# EAGLE design Pi_CPU_002 (EAGLE 6.4)
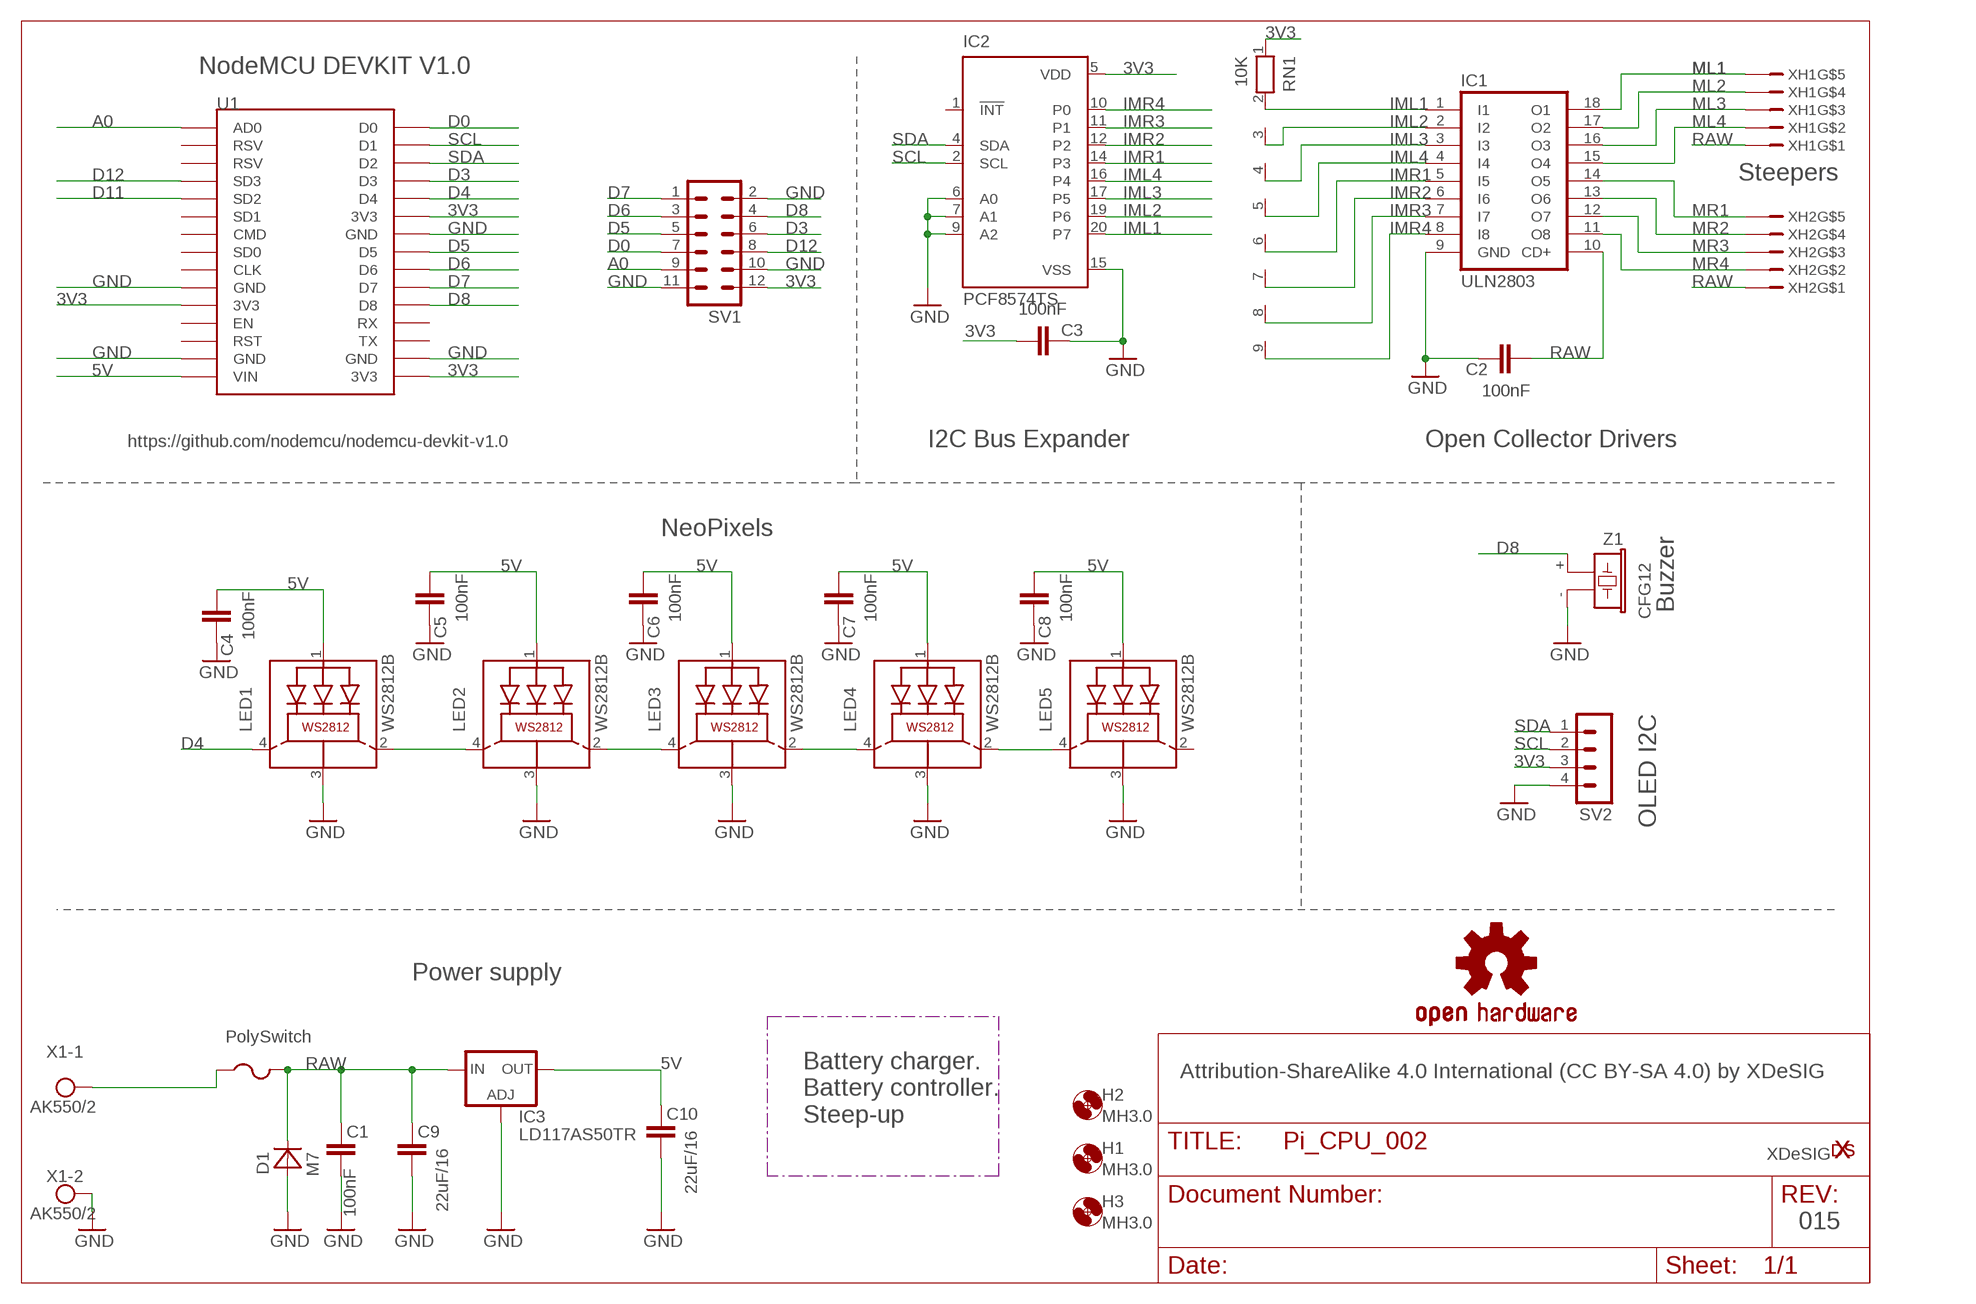
[diagram p0: schematic, sheet 1]

## Parts
C1  100nF  C-EUC0603K  [C0603K]
C2  100nF  C-EUC0603K  [C0603K]
C3  100nF  C-EUC0603K  [C0603K]
C4  100nF  C-EUC0603K  [C0603K]
C5  100nF  C-EUC0603K  [C0603K]
C6  100nF  C-EUC0603K  [C0603K]
C7  100nF  C-EUC0603K  [C0603K]
C8  100nF  C-EUC0603K  [C0603K]
C9  22uF/16  C-EUC1206  [C1206]
C10  22uF/16  C-EUC1206  [C1206]
D1  M7  MBRA340T3  [SMA]
F1  PolySwitch  PTCFUSE-1206  [R1206]
H1  MH3.0  MOUNT-HOLE3.0  [3,0]
H2  MH3.0  MOUNT-HOLE3.0  [3,0]
H3  MH3.0  MOUNT-HOLE3.0  [3,0]
IC1  ULN2803  ULN2803A  [DIL18]
IC2  PCF8574TS  [SSOP20]
IC3  LD117AS50TR  [SOT223]
LED1  WS2812B  [5050-4]
LED2  WS2812B  [5050-4]
LED3  WS2812B  [5050-4]
LED4  WS2812B  [5050-4]
LED5  WS2812B  [5050-4]
LOGO2  OSHW-LOGOS  [OSHW-LOGO-S]
RN1  10K  RN08  [RN-9]
SV1  MA06-2  [MA06-2]
SV2  MA04-1  [MA04-1]
U1  ESP12E_DEVKIT  [ESP12E_DEVKIT]
U$13  XDESIG_XDESIG21  [XDESIG_XDESIG]
X1  AK550/2  [AK550/2]
XDS1  XDESIG  [XDESIG_CU_2]
XH1  B5B-XH-A  [B5B-XH-A]
XH2  B5B-XH-A  [B5B-XH-A]
Z1  CFG12  F/CM12P  [F/CM12P]

## Nets
3V3: C3.2 IC2.5(VDD) RN1.1 SV1.12 SV2.3 U1.3V3@0(3V3) U1.3V3@1(3V3) U1.3V3@2(3V3)
5V: C4.2 C5.2 C6.2 C7.2 C8.2 C10.2 IC3.4(OUT) LED1.1(LEDVDD) LED2.1(LEDVDD) LED3.1(LEDVDD) LED4.1(LEDVDD) LED5.1(LEDVDD) U1.VIN
A0: SV1.9 U1.AD0
D0: SV1.7 U1.D0
D3: SV1.6 U1.D3
D4: LED1.4(DI) U1.D4
D5: SV1.5 U1.D5
D6: SV1.3 U1.D6
D7: SV1.1 U1.D7
D8: SV1.4 U1.D8 Z1.+
D11: U1.SD2
D12: SV1.8 U1.SD3
GND: C1.1 C2.1 C3.1 C4.1 C5.1 C6.1 C7.1 C8.1 C9.1 C10.1 D1.A IC1.9(GND) IC2.6(A0) IC2.7(A1) IC2.9(A2) IC2.15(VSS) IC3.1(ADJ) LED1.3(GND) LED2.3(GND) LED3.3(GND) LED4.3(GND) LED5.3(GND) SV1.2 SV1.10 SV1.11 SV2.4 U1.GND@0(GND) U1.GND@1(GND) U1.GND@2(GND) U1.GND@3(GND) X1.2 Z1.-
IML1: IC1.1(I1) IC2.20(P7) RN1.2
IML2: IC1.2(I2) IC2.19(P6) RN1.3
IML3: IC1.3(I3) IC2.17(P5) RN1.4
IML4: IC1.4(I4) IC2.16(P4) RN1.5
IMR1: IC1.5(I5) IC2.14(P3) RN1.6
IMR2: IC1.6(I6) IC2.12(P2) RN1.7
IMR3: IC1.7(I7) IC2.11(P1) RN1.8
IMR4: IC1.8(I8) IC2.10(P0) RN1.9
ML1: IC1.18(O1) XH1.P$5
ML2: IC1.17(O2) XH1.P$4
ML3: IC1.16(O3) XH1.P$3
ML4: IC1.15(O4) XH1.P$2
MR1: IC1.14(O5) XH2.P$5
MR2: IC1.13(O6) XH2.P$4
MR3: IC1.12(O7) XH2.P$3
MR4: IC1.11(O8) XH2.P$2
N$1: F1.1 X1.1
N$10: LED1.2(DO) LED2.4(DI)
N$14: LED3.2(DO) LED4.4(DI)
N$15: LED2.2(DO) LED3.4(DI)
N$16: LED4.2(DO) LED5.4(DI)
RAW: C1.2 C2.2 C9.2 D1.C F1.2 IC1.10(CD+) IC3.3(IN) XH1.P$1 XH2.P$1
SCL: IC2.2(SCL) SV2.2 U1.D1
SDA: IC2.4(SDA) SV2.1 U1.D2
Unconnected: IC2.1(!INT) LED5.2(DO) U1.CLK U1.CMD U1.EN U1.RST U1.RSV@0(RSV) U1.RSV@1(RSV) U1.RX U1.SD0 U1.SD1 U1.TX

## Notes on the sheet
- NodeMCU DEVKIT V1.0
- Steepers
- https://github.com/nodemcu/nodemcu-devkit-v1.0 | I2C Bus Expander | Open Collector Drivers
- NeoPixels | Buzzer
- OLED I2C
- Power supply
- Attribution-ShareAlike 4.0 International (CC BY-SA 4.0) by XDeSIG
- Battery charger.
  Battery controller.
  Steep-up
- XDeSIG
- 015

## Library data of the parts
C1-C10 = rcl:C-EU: CAPACITOR, European symbol
D1 = diode:MBRA340T3: Surface Mount Schottky Power Rectifier Source: http://www.onsemi.com/pub_link/Collateral/MBRA340T3-D.PDF
F1 = adafruit:PTCFUSE: PTC fuses, resettable thermistors
H1-H3 = holes:MOUNT-HOLE: MOUNTING HOLE with drill center marker
IC1 = uln-udn:ULN2803A: DRIVER ARRAY
IC2 = micro-philips:PCF8574: I2C-Bus Remote 8-bit I/O expander http://www.semiconductors.philips.com/acrobat_download/datasheets/PCF8574_4.pdf; MPN: PCF8574TS/3,118; OC_FARNELL: 1506644; OC_NEWARK: 70R6873
IC3 = v-reg:LD117A?*: Low drop fixed and adjustable positive voltage regulators 1 A Source: http://www.st.com/stonline/products/literature/ds/7194/ld1117axx.pdf
LED1-LED5 = adafruit:WS2812B
LOGO2 = SparkFun-Aesthetics:OSHW-LOGO: Open Source Hardware Logo This logo indicates the piece of hardware it is found on incorporates a OSHW license and/or adheres to the definition of open source hardware found here: http://freedomdefined.org/OSHW
RN1 = resistor-net:RN08: RESISTOR NETWORK; OC_FARNELL: unknown; OC_NEWARK: unknown
SV1 = con-lstb:MA06-2: PIN HEADER; OC_FARNELL: unknown; OC_NEWARK: unknown
SV2 = con-lstb:MA04-1: PIN HEADER; OC_FARNELL: unknown; OC_NEWARK: unknown
U1 = ESP12E_DEVKIT09:ESP12E_DEVKIT: ESP12E DEVKIT BOARD
U$13 = Escorna_CPU_2_01:XDESIG_XDESIG
X1 = con-ptr500:AK550/2: CONNECTOR; OC_FARNELL: unknown; OC_NEWARK: unknown
XDS1 = xdesig:XDESIG
XH1 XH2 = con-jst:B5B-XH-A
Z1 = buzzer:F/CM12P: BUZZER Source: Buerklin; OC_FARNELL: unknown; OC_NEWARK: unknown

## Net classes
1 power: width 0.254 mm, drill 0.61 mm, clearance 0.254 mm

## Board
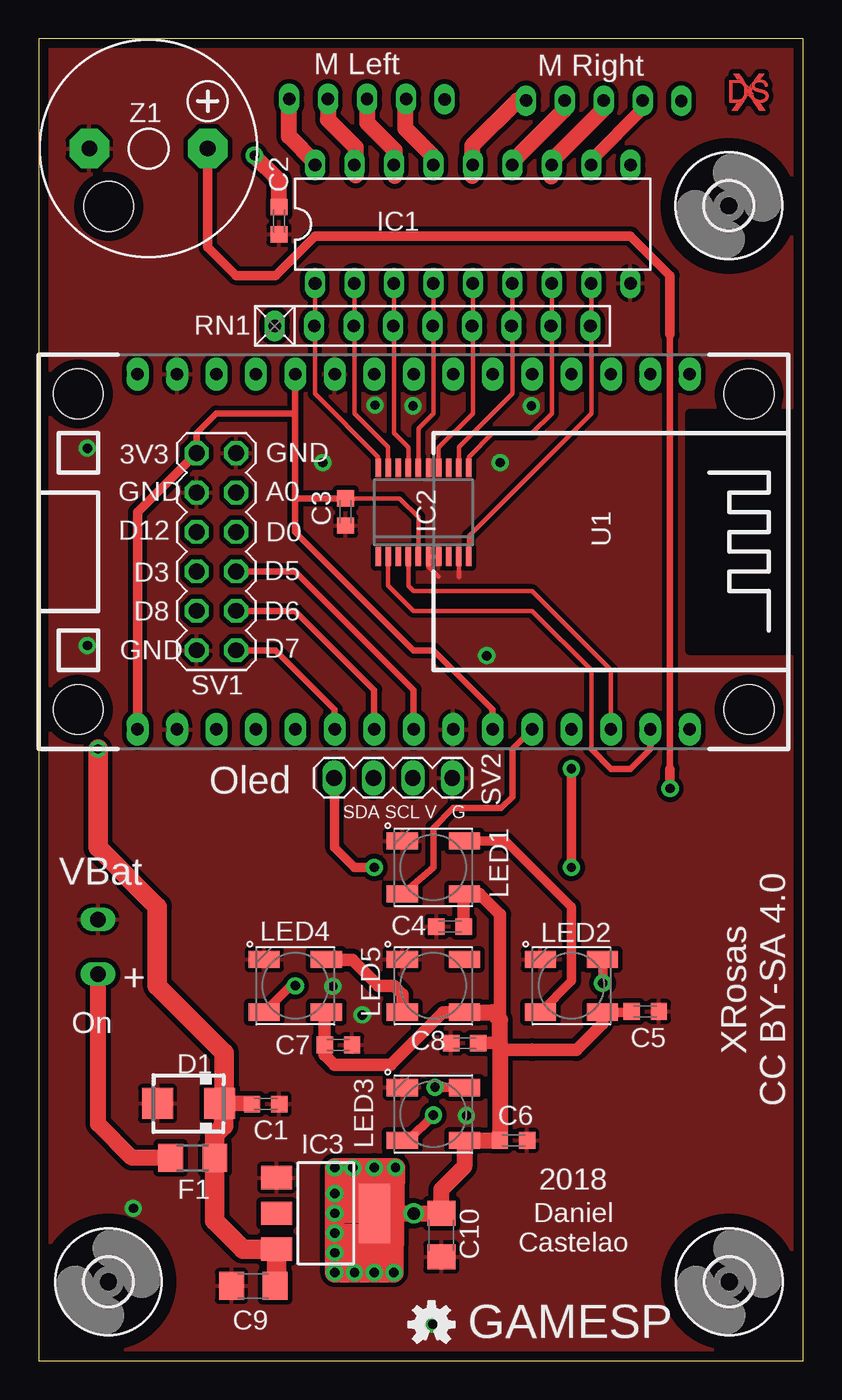
[diagram p1: board, top side]
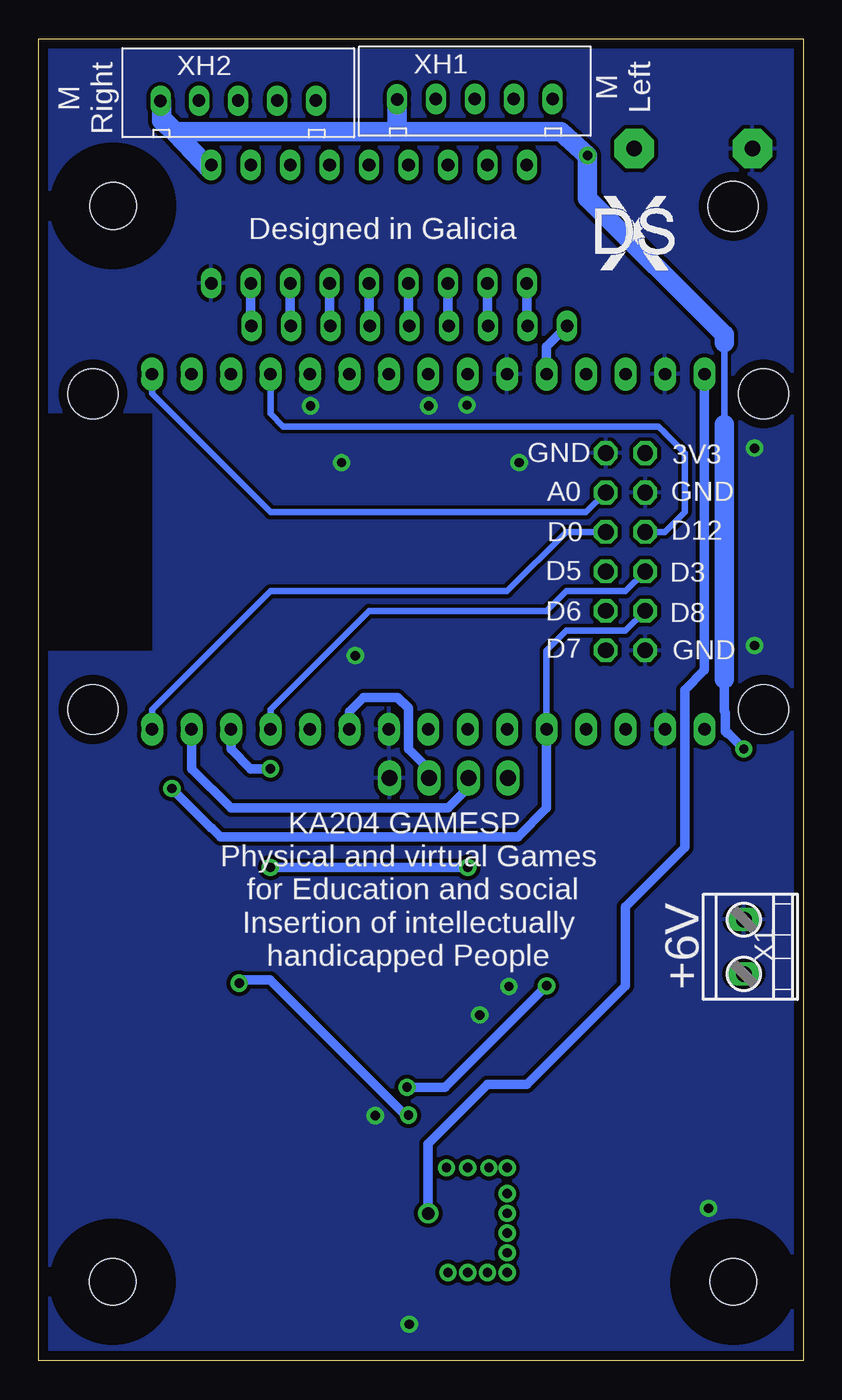
[diagram p2: board, bottom side, seen from below]

Size 49.2 x 85.08 mm. Coordinates in mm from the lower left corner, seen from the top.
Outline: 0,0 49.2,0 49.2,85.08 0,85.08 0,0
Copper layers (1*16): Top 0.035mm / dielectric 1.5mm / Bottom 0.035mm
Design rules "default": minimum track width 10mil, minimum drill 22mil, track to track 10mil, track to pad 10mil, pad to pad 8mil, via to via 12mil, smd to smd 8mil, copper to edge 24mil, drill to drill 12mil, minimum pad ring 10mil, minimum via ring 10mil, stop-mask expansion 2mil, vias tented up to drill 30mil, thermal gap 10mil
Holes 3.2 mm at 4.5,74.3
tRestrict: area 41.9,45.7 to 49.5,61
bRestrict: area 41.9,45.7 to 49.5,61

### Footprints (pad centres in the part's own frame; a part is rotated, then mirrored left to right if it is on the bottom)
C0603K = smd 1.05 x 1.08: 1 -0.875,0; 2 0.875,0
C1206 = smd 1.6 x 1.8: 1 -1.4,0; 2 1.4,0
SMA = smd 2 x 2: A 2,0; C -2,0
R1206 = smd 1.6 x 1.803: 1 -1.422,0; 2 1.422,0
3,0 = hole 3: 0,0
DIL18 = drill 0.813 long: 1 -10.16,-3.81; 2 -7.62,-3.81; 3 -5.08,-3.81; 4 -2.54,-3.81; 5 0,-3.81; 6 2.54,-3.81; 7 5.08,-3.81; 8 7.62,-3.81; 9 10.16,-3.81; 10 10.16,3.81; 11 7.62,3.81; 12 5.08,3.81; 13 2.54,3.81; 14 0,3.81; 15 -2.54,3.81; 16 -5.08,3.81; 17 -7.62,3.81; 18 -10.16,3.81
SSOP20 = smd 0.35 x 1.2: 1 -2.925,-2.85; 2 -2.275,-2.85; 3 -1.625,-2.85; 4 -0.975,-2.85; 5 -0.325,-2.85; 6 0.325,-2.85; 7 0.975,-2.85; 8 1.625,-2.85; 9 2.275,-2.85; 10 2.925,-2.85; 11 2.925,2.85; 12 2.275,2.85; 13 1.625,2.85; 14 0.975,2.85; 15 0.325,2.85; 16 -0.325,2.85; 17 -0.975,2.85; 18 -1.625,2.85; 19 -2.275,2.85; 20 -2.925,2.85
SOT223 = smd 1.5 x 2: 1 -2.3,-3.15; 2 0,-3.15; 3 2.3,-3.15 | smd 3.8 x 2: 4 0,3.15
5050-4 = smd 2 x 1.1: 1 -2,1.7; 2 -2,-1.7; 3 2,-1.7; 4 2,1.7
RN-9 = drill 0.813 long: 1 -10.16,0; 2 -7.62,0; 3 -5.08,0; 4 -2.54,0; 5 0,0; 6 2.54,0; 7 5.08,0; 8 7.62,0; 9 10.16,0
MA06-2 = drill 1.016 octagon: 1 -6.35,-1.27; 2 -6.35,1.27; 3 -3.81,-1.27; 4 -3.81,1.27; 5 -1.27,-1.27; 6 -1.27,1.27; 7 1.27,-1.27; 8 1.27,1.27; 9 3.81,-1.27; 10 3.81,1.27; 11 6.35,-1.27; 12 6.35,1.27
MA04-1 = drill 1.016 long: 1 -3.81,0; 2 -1.27,0; 3 1.27,0; 4 3.81,0
ESP12E_DEVKIT = drill 0.8 pad 1.422 long: 3V3@0 -11.43,-7.62; 3V3@1 11.43,5.08; 3V3@2 11.43,-17.78; AD0 -11.43,17.78; CLK -11.43,-2.54; CMD -11.43,2.54; D0 11.43,17.78; D1 11.43,15.24; D2 11.43,12.7; D3 11.43,10.16; D4 11.43,7.62; D5 11.43,0; D6 11.43,-2.54; D7 11.43,-5.08; D8 11.43,-7.62; EN -11.43,-10.16; GND@0 -11.43,-5.08; GND@1 -11.43,-15.24; GND@2 11.43,2.54; GND@3 11.43,-15.24; RST -11.43,-12.7; RSV@0 -11.43,15.24; RSV@1 -11.43,12.7; RX 11.43,-10.16; SD0 -11.43,0; SD1 -11.43,5.08; SD2 -11.43,7.62; SD3 -11.43,10.16; TX 11.43,-12.7; VIN -11.43,-17.78 | hole 3.2: -10.16,21.59; 10.16,21.59; 10.16,-21.59; -10.16,-21.59
AK550/2 = drill 1 pad 1.5 long: 1 -1.75,0; 2 1.75,0
B5B-XH-A = drill 0.8 long: P$1 -5.17,-0.19; P$2 -2.69,-0.175; P$3 -0.175,-0.175; P$4 2.34,-0.175; P$5 4.83,-0.175
F/CM12P = drill 1.016 pad 2.54 octagon: + 3.81,0; - -3.81,0

### Placement (x,y rotation side)
C1  14.6,16.52 180 top
C2  15.46,73.37 90 top
C3  19.75,54.63 90 top
C4  26.47,27.94 0 top
C5  39.04,22.48 180 top
C6  30.56,14.19 180 top
C7  19.29,20.32 180 top
C8  27.42,20.44 0 top
C9  13.8,4.81 0 top
C10  25.91,8.08 90 top
D1  9.64,16.55 180 top
F1  9.91,13.06 0 top
H1  4.48,5.08 0 top
H2  44.45,5.08 0 top
H3  44.42,74.33 0 top
IC1  27.94,73.16 0 top
IC2  24.77,54.61 0 top
IC3  18.47,9.48 270 top
LED1  25.4,31.75 180 top
LED2  34.29,24.13 180 top
LED3  25.4,15.88 180 top
LED4  16.51,24.13 180 top
LED5  25.4,24.13 180 top
LOGO2  25.28,2.33 0 top
RN1  25.35,66.6 0 top
SV1  11.43,52.07 90 top
SV2  22.81,37.51 0 top
U1  24.13,52.07 270 top
U$13  13.34,70.21 0 bottom
X1  3.81,26.64 90 bottom
XDS1  44.45,80.47 0 top
XH1  20.95,81.38 0 bottom
XH2  36.2,81.28 0 bottom
Z1  7.07,78.02 0 top

### Tracks (layer width: path | path; a pad name or v marks a point on that pad's centre or on a via)
3V3
  Top 0.305: C3.2 23.23,55.51 24.44,54.3 IC2.5
  Top 0.406: U1.3V3@1 29.21,41.91 25.4,45.72 24.13,45.72 16.51,53.34 16.51,55.63 | U1.3V3@0 16.51,60.96 | 16.51,60.96 16.51,55.63 | SV1.12 10.16,59.69 11.43,60.96 16.51,60.96 | C3.2 16.64,55.51 16.51,55.63
  Top 0.61: U1.3V3@2 6.35,54.61 SV1.12
  Bottom 0.61: U1.3V3@0 16.51,65.28 RN1.1 | SV2.3 24.08,38.05 25.4,39.37 25.4,42 26.1,42.7 28.31,42.7 29.21,41.8 U1.3V3@1
5V  (via drill 0.6, 0.8)
  Top 0.254: 31.75,20.32 31.75,20
  Top 0.61: LED2.1 38.38,22.43 C5.2
  Top 0.813: 29.47,22.43 29.7,22.2 29.7,28.72 28.37,30.05 LED1.1 27.34,30 C4.2 | LED2.1 36.29,21.69 34.6,20 31.75,20 29.7,20 29.7,20.32 29.58,20.44 C8.2 | LED4.1 18.41,22.33 C7.2 18.41,19.69 19.05,19.05 22.65,19.05 26.03,22.43 LED5.1
  Top 1.016: LED5.1 29.2,22.43 | 29.2,22.43 29.47,22.43 | IC3.4 v24.13,9.48 C10.2 25.9,11 27.4,12.5 LED3.1 29.64,14.18 C6.2 29.7,14.23 29.7,20 | 29.7,20.32 29.7,21.93 29.2,22.43
  Top 1.27: v21.59,5.67 v22.86,5.67 22.86,6.54 21.2,8.2 21.2,8.01 21.59,7.62 v21.59,5.67 | v21.59,5.67 v20.32,5.67 | v20.32,5.67 v19.05,5.67 v19.05,6.94 | v19.05,6.94 v19.05,8.21 | v19.05,8.21 v19.05,9.48 | v19.05,9.48 v19.05,10.75 | v19.05,10.75 v19.05,12.42 | v19.05,12.42 v20.22,12.42 | v20.22,12.42 v21.59,12.42 | v21.59,12.42 v22.96,12.42 22.86,6.35 22.27,6.94 20.32,6.94 | v21.59,12.42 21.89,11.05 | 21.89,11.05 21.59,10.16 20.95,10.79 | 21.89,11.05 v20.22,12.42 | v19.05,12.42 19.73,12.02 20.95,10.79 | v19.05,10.75 20.91,10.75 20.95,10.79 | v19.05,9.48 IC3.4 21.59,9.45 21.59,8.89 20.91,8.21 v19.05,8.21 | v19.05,6.94 20.32,6.94 | v20.32,5.67 20.32,6.94
  Bottom 0.61: U1.VIN 6.35,44.45 7.62,43.18 7.62,33.02 11.43,29.21 11.43,24.13 17.78,17.78 20.32,17.78 24.13,13.97 v24.13,9.48
A0
  Bottom 0.406: U1.AD0 41.91,62.23 34.29,54.61 13.97,54.61 SV1.9
D0
  Bottom 0.406: U1.D0 41.91,41.91 34.29,49.53 19.05,49.53 15.24,53.34 SV1.7
D3
  Bottom 0.406: U1.D3 34.29,41.91 27.94,48.26 16.51,48.26 15.24,49.53 11.43,49.53 SV1.6
D4
  Top 0.406: U1.D4 30.48,39.37 30.48,36.28 29.76,35.56 26.67,35.56 25.4,34.29 25.4,31.75 LED1.4
D5
  Top 0.406: U1.D5 24.13,43.18 16.51,50.8 SV1.5
D6
  Top 0.406: SV1.3 16.51,48.26 21.59,43.18 U1.D6
D7
  Top 0.406: U1.D7 19.05,41.91 15.24,45.72 SV1.1
D8  (via drill 0.6)
  Top 0.406: 40.64,66.04 40.64,38.1
  Top 0.61: 40.64,66.04 40.64,69.85 38.1,72.39 17.78,72.39 15.24,69.85 12.7,69.85 10.88,71.67 Z1.+ | v40.64,36.83 40.64,38.1
  Bottom 0.406: SV1.4 11.43,46.99 15.24,46.99 16.51,45.72 U1.D8
  Bottom 0.61: v40.64,36.83 38.1,34.29 38.09,34.29 37.5,33.7 18.37,33.7 16.51,35.56 U1.D8
D12
  Bottom 0.406: U1.SD3 34.29,60.96 33.46,60.13 9.3,60.13 8.89,59.72 8.89,59.69 7.62,58.42 7.62,54.61 8.89,53.34 SV1.8
GND  (via drill 0.6)
  Top 0.305: IC2.9 27.04,50.43 | 25.74,50.46 25.09,51.11
  other vias: 20.82,22.25 18.93,24.09 29.71,57.81 3.12,46.03 3.12,58.73 25.35,2.34 28.83,45.38 6.08,9.81 27.54,15.77 18.28,57.81 24.09,61.46 21.64,61.5 31.71,61.46
  pour Top (isolate 0.305): 0,86.36 50.8,86.36 50.8,0 0,0
  pour Bottom: -1.27,86.36 50.8,86.36 50.8,-1.27 -1.27,-1.27
IML1
  Top 0.305: IC2.20 21.84,58.17 17.78,62.23 IC1.1
  Bottom 0.61: IC1.1 17.78,66.65 RN1.2
IML2
  Top 0.305: IC1.2 20.32,60.96 22.49,58.79 IC2.19
  Bottom 0.61: IC1.2 20.32,66.65 RN1.3
IML3
  Top 0.305: IC2.17 23.79,58.76 22.86,59.69 IC1.3
  Bottom 0.61: IC1.3 22.86,66.65 RN1.4
IML4
  Top 0.305: IC2.16 24.44,60 25.4,60.96 IC1.4
  Bottom 0.61: IC1.4 25.4,66.65 RN1.5
IMR1
  Top 0.305: IC2.14 25.74,58.76 27.94,60.96 IC1.5
  Bottom 0.61: IC1.5 27.94,66.65 RN1.6
IMR2
  Top 0.305: IC2.12 27.04,58.79 29.21,60.96 30.48,62.23 IC1.6
  Bottom 0.61: IC1.6 30.48,66.65 RN1.7
IMR3
  Top 0.305: IC2.11 27.69,58.17 29.21,59.69 31.75,59.69 33.02,60.96 IC1.7
  Bottom 0.61: IC1.7 33.02,66.65 RN1.8
IMR4
  Top 0.305: IC2.10 27.69,53.09 35.56,60.96 IC1.8
  Bottom 0.61: IC1.8 35.56,66.65 RN1.9
ML1
  Top 1.016: IC1.18 17.78,77.12 16.1,78.8 16.1,81.08 XH1.P$5
ML2
  Top 1.016: XH1.P$4 18.61,79.89 20.4,78.1 20.4,76.28 IC1.17
ML3
  Top 1.016: XH1.P$3 21.13,79.67 22.9,77.9 22.9,76.24 IC1.16
ML4
  Top 1.016: IC1.15 25.4,77.5 23.6,79.3 23.6,81.06 XH1.P$2
MR1
  Top 1.016: XH2.P$5 30.8,81.11 27.9,78.2 27.9,76.24 IC1.14
MR2
  Top 1.016: IC1.13 30.48,77.18 33.85,80.56 XH2.P$4
MR3
  Top 1.016: XH2.P$3 36.37,80.57 33,77.2 33,76.22 IC1.12
MR4
  Top 0.813: IC1.11 35.56,77.26 38.9,80.6 38.9,81.09 XH2.P$2
N$1
  Top 1.016: F1.1 5.99,13.06 3.81,15.24 X1.1
N$10
  Top 0.61: LED1.2 30.05,33.45 34.29,29.21 34.29,24.43 LED2.4
N$14  (via drill 0.6)
  Top 0.61: LED3.2 25.52,17.57 v25.5,17.6 | v16.51,24.13 16.21,24.13 LED4.4
  Bottom 0.61: v25.5,17.6 23.04,17.6 v16.51,24.13
N$15  (via drill 0.6)
  Top 0.61: LED3.4 23.77,14.18 v25.4,15.8 | v36.3,24.3 LED2.2
  Bottom 0.61: v25.4,15.8 25.6,15.8 34.3,24.5 36.1,24.5 v36.3,24.3
N$16
  Top 0.813: 18.54,25.8 LED4.2 18.54,25.8 | LED5.4 23.4,23.59 22.86,24.13 21.87,24.13 20.2,25.8 18.54,25.8
RAW  (via drill 0.6)
  Top 1.016: 15.24,7.1 IC3.3 | 11.39,13.3 F1.2 | C2.2 15.46,75.98 v13.87,77.57 | C1.2 11.95,16.57
  Top 1.27: v3.81,39.37 3.81,33.02 7.62,29.21 7.62,24.13 11.93,19.82 11.93,16.84 D1.C 11.66,16.57 11.91,16.57 | 11.95,16.57 11.91,16.57 | 11.91,16.57 11.9,16.56 11.9,15.1 11.33,14.53 F1.2 11.33,8.99 13.14,7.18 IC3.3 15.32,5.16 15.24,5.08 15.24,4.85 C9.2
  Bottom 0.406: 5.08,60.26 5.08,65.54
  Bottom 0.61: 5.08,43.88 5.08,41.81 5,41.73 5,40.5 4.86,40.36 4.8,40.36 v3.81,39.37
  Bottom 1.27: 5.08,43.88 5.08,60.26 | 5.08,65.54 5.08,66.04 13.87,74.83 v13.87,77.57 15.6,79.1 26,79.1 | 41.3,80.01 41.3,79.8 40.4,79 38.1,76.6 IC1.10 | 41.3,80.01 41.3,81.03 XH2.P$1 | 26,79.1 40.39,79.1 41.3,80.01 | XH1.P$1 26.12,79.22 26,79.1
SCL
  Top 0.305: 35.56,39.37 35.56,44.45 31.75,48.26 24.13,48.26 22.49,49.9 IC2.2
  Top 0.406: U1.D1 39.37,39.37 38.1,38.1 36.83,38.1 35.56,39.37
  Bottom 0.61: SV2.2 21.54,36.88 22.86,35.56 36.83,35.56 39.37,38.1 U1.D1
SDA  (via drill 0.6)
  Top 0.305: U1.D2 36.83,44.45 31.75,49.53 24.13,49.53 23.79,49.87 IC2.4
  Top 0.61: v34.29,38.1 v34.29,31.75 | v21.59,31.75 20.32,31.75 19.05,33.02 19.05,37.46 SV2.1
  Bottom 0.61: v34.29,38.1 35.56,38.1 36.83,39.37 U1.D2 | v21.59,31.75 v34.29,31.75

### Text on the board
tPlace: M Left | M Right | 3V3 | GND | GND | A0 | D12 | D0 | D3 | D5 | D8 | D6 | GND | D7 | Oled | SDA SCL V G | VBat | + | XRosas / CC BY-SA 4.0 | On | 2018 | Daniel / Castelao | GAMESP
bPlace: M / Left | M / Right | Designed in Galicia | 3V3 | GND | GND | A0 | D12 | D0 | D3 | D5 | D8 | D6 | GND | D7 | +6V | KA204 GAMESP / Physical and virtual Games / for Education and social / Insertion of intellectually / handicapped People